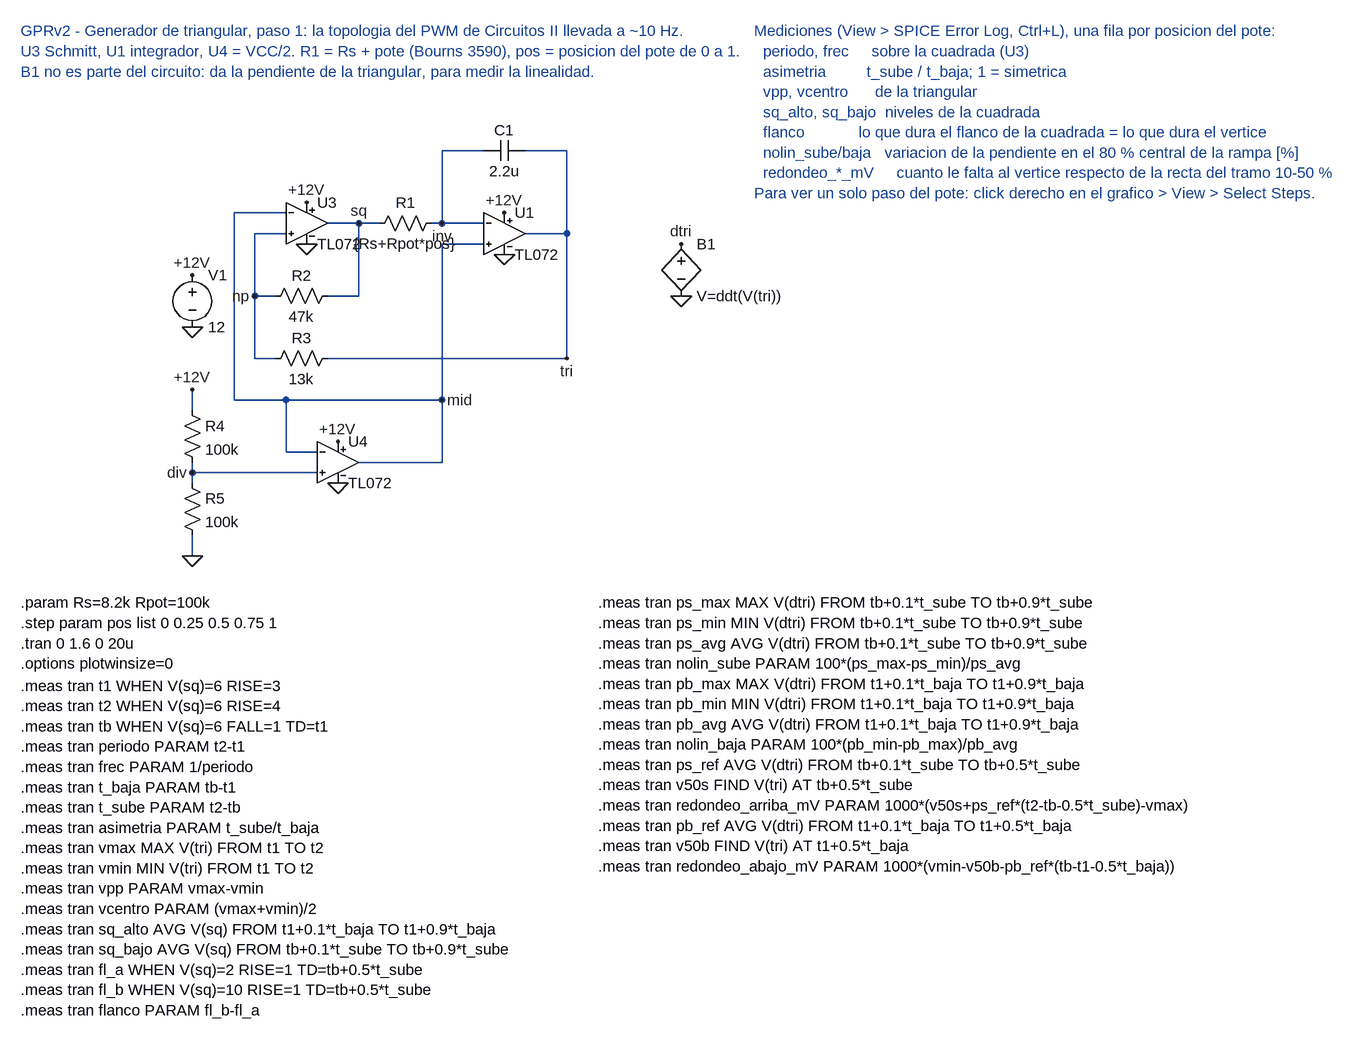
[diagram p0: schematic triangular.asc]
triangular.asc, the LTspice schematic file:
Version 4.1
SHEET 1 1592 1300
WIRE 384 -16 320 -16
WIRE 512 -16 448 -16
WIRE 80 80 0 80
WIRE 192 96 144 96
WIRE 224 96 192 96
WIRE 320 96 320 -16
WIRE 320 96 304 96
WIRE 384 96 320 96
WIRE 80 112 32 112
WIRE 512 112 512 -16
WIRE 512 112 448 112
WIRE 384 128 320 128
WIRE 32 208 32 112
WIRE 64 208 32 208
WIRE 192 208 192 96
WIRE 192 208 144 208
WIRE 32 304 32 208
WIRE 64 304 32 304
WIRE 512 304 512 112
WIRE 512 304 144 304
WIRE 0 368 0 80
WIRE 80 368 0 368
WIRE 320 368 320 128
WIRE 320 368 80 368
WIRE -64 384 -64 352
WIRE 80 448 80 368
WIRE 128 448 80 448
WIRE 320 464 320 368
WIRE 320 464 192 464
WIRE -64 480 -64 464
WIRE 128 480 -64 480
WIRE -64 496 -64 480
WIRE -64 608 -64 576
FLAG -64 256 0
FLAG -64 176 +12V
FLAG -64 608 0
FLAG 160 496 0
FLAG 112 128 0
FLAG 416 144 0
FLAG 112 64 +12V
FLAG 416 80 +12V
FLAG 160 432 +12V
FLAG -64 352 +12V
FLAG 192 96 sq
FLAG 32 208 np
FLAG 320 96 inv
FLAG 512 304 tri
FLAG 320 368 mid
FLAG -64 480 div
FLAG 688 128 dtri
FLAG 688 208 0
SYMBOL res 320 80 R90
WINDOW 0 0 56 VBottom 2
WINDOW 3 32 56 VTop 2
SYMATTR InstName R1
SYMATTR Value {Rs+Rpot*pos}
SYMBOL cap 448 -32 R90
WINDOW 0 0 32 VBottom 2
WINDOW 3 32 32 VTop 2
SYMATTR InstName C1
SYMATTR Value 2.2u
SYMBOL res 160 192 R90
WINDOW 0 0 56 VBottom 2
WINDOW 3 32 56 VTop 2
SYMATTR InstName R2
SYMATTR Value 47k
SYMBOL res 160 288 R90
WINDOW 0 0 56 VBottom 2
WINDOW 3 32 56 VTop 2
SYMATTR InstName R3
SYMATTR Value 13k
SYMBOL voltage -64 160 R0
WINDOW 123 0 0 Left 0
WINDOW 39 0 0 Left 0
SYMATTR InstName V1
SYMATTR Value 12
SYMBOL res -80 368 R0
SYMATTR InstName R4
SYMATTR Value 100k
SYMBOL res -80 480 R0
SYMATTR InstName R5
SYMATTR Value 100k
SYMBOL TL072 416 48 R0
SYMATTR InstName U1
SYMBOL TL072 112 32 R0
SYMATTR InstName U3
SYMBOL TL072 160 400 R0
SYMATTR InstName U4
SYMBOL bv 688 112 R0
SYMATTR InstName B1
SYMATTR Value V=ddt(V(tri))
TEXT -328 -200 Left 2 ;GPRv2 - Generador de triangular, paso 1: la topologia del PWM de Circuitos II llevada a ~10 Hz.\nU3 Schmitt, U1 integrador, U4 = VCC/2. R1 = Rs + pote (Bourns 3590), pos = posicion del pote de 0 a 1.\nB1 no es parte del circuito: da la pendiente de la triangular, para medir la linealidad.
TEXT -328 680 Left 2 !.param Rs=8.2k Rpot=100k\n.step param pos list 0 0.25 0.5 0.75 1\n.tran 0 1.6 0 20u\n.options plotwinsize=0
TEXT -328 808 Left 2 !.meas tran t1 WHEN V(sq)=6 RISE=3\n.meas tran t2 WHEN V(sq)=6 RISE=4\n.meas tran tb WHEN V(sq)=6 FALL=1 TD=t1\n.meas tran periodo PARAM t2-t1\n.meas tran frec PARAM 1/periodo\n.meas tran t_baja PARAM tb-t1\n.meas tran t_sube PARAM t2-tb\n.meas tran asimetria PARAM t_sube/t_baja\n.meas tran vmax MAX V(tri) FROM t1 TO t2\n.meas tran vmin MIN V(tri) FROM t1 TO t2\n.meas tran vpp PARAM vmax-vmin\n.meas tran vcentro PARAM (vmax+vmin)/2\n.meas tran sq_alto AVG V(sq) FROM t1+0.1*t_baja TO t1+0.9*t_baja\n.meas tran sq_bajo AVG V(sq) FROM tb+0.1*t_sube TO tb+0.9*t_sube\n.meas tran fl_a WHEN V(sq)=2 RISE=1 TD=tb+0.5*t_sube\n.meas tran fl_b WHEN V(sq)=10 RISE=1 TD=tb+0.5*t_sube\n.meas tran flanco PARAM fl_b-fl_a
TEXT 560 680 Left 2 !.meas tran ps_max MAX V(dtri) FROM tb+0.1*t_sube TO tb+0.9*t_sube\n.meas tran ps_min MIN V(dtri) FROM tb+0.1*t_sube TO tb+0.9*t_sube\n.meas tran ps_avg AVG V(dtri) FROM tb+0.1*t_sube TO tb+0.9*t_sube\n.meas tran nolin_sube PARAM 100*(ps_max-ps_min)/ps_avg\n.meas tran pb_max MAX V(dtri) FROM t1+0.1*t_baja TO t1+0.9*t_baja\n.meas tran pb_min MIN V(dtri) FROM t1+0.1*t_baja TO t1+0.9*t_baja\n.meas tran pb_avg AVG V(dtri) FROM t1+0.1*t_baja TO t1+0.9*t_baja\n.meas tran nolin_baja PARAM 100*(pb_min-pb_max)/pb_avg\n.meas tran ps_ref AVG V(dtri) FROM tb+0.1*t_sube TO tb+0.5*t_sube\n.meas tran v50s FIND V(tri) AT tb+0.5*t_sube\n.meas tran redondeo_arriba_mV PARAM 1000*(v50s+ps_ref*(t2-tb-0.5*t_sube)-vmax)\n.meas tran pb_ref AVG V(dtri) FROM t1+0.1*t_baja TO t1+0.5*t_baja\n.meas tran v50b FIND V(tri) AT t1+0.5*t_baja\n.meas tran redondeo_abajo_mV PARAM 1000*(vmin-v50b-pb_ref*(tb-t1-0.5*t_baja))
TEXT 800 -200 Left 2 ;Mediciones (View > SPICE Error Log, Ctrl+L), una fila por posicion del pote:\n  periodo, frec     sobre la cuadrada (U3)\n  asimetria         t_sube / t_baja; 1 = simetrica\n  vpp, vcentro      de la triangular\n  sq_alto, sq_bajo  niveles de la cuadrada\n  flanco            lo que dura el flanco de la cuadrada = lo que dura el vertice\n  nolin_sube/baja   variacion de la pendiente en el 80 % central de la rampa [%]\n  redondeo_*_mV     cuanto le falta al vertice respecto de la recta del tramo 10-50 %\nPara ver un solo paso del pote: click derecho en el grafico > View > Select Steps.

The netlist it stands for:
* triangular.asc
R1 inv sq {Rs+Rpot*pos}
C1 tri inv 2.2u
R2 sq np 47k
R3 tri np 13k
V1 +12V 0 12
R4 +12V div 100k
R5 div 0 100k
X§U1 mid inv +12V 0 tri TL072  ; pins In+ In- V+ V- OUT
X§U3 np mid +12V 0 sq TL072  ; pins In+ In- V+ V- OUT
X§U4 div mid +12V 0 mid TL072  ; pins In+ In- V+ V- OUT
B1 dtri 0 V=ddt(V(tri))
* GPRv2 - Generador de triangular, paso 1: la topologia del PWM de Circuitos II llevada a ~10 Hz.
* U3 Schmitt, U1 integrador, U4 = VCC/2. R1 = Rs + pote (Bourns 3590), pos = posicion del pote de 0 a 1.
* B1 no es parte del circuito: da la pendiente de la triangular, para medir la linealidad.
.param Rs=8.2k Rpot=100k
.step param pos list 0 0.25 0.5 0.75 1
.tran 0 1.6 0 20u
.options plotwinsize=0
.meas tran t1 WHEN V(sq)=6 RISE=3
.meas tran t2 WHEN V(sq)=6 RISE=4
.meas tran tb WHEN V(sq)=6 FALL=1 TD=t1
.meas tran periodo PARAM t2-t1
.meas tran frec PARAM 1/periodo
.meas tran t_baja PARAM tb-t1
.meas tran t_sube PARAM t2-tb
.meas tran asimetria PARAM t_sube/t_baja
.meas tran vmax MAX V(tri) FROM t1 TO t2
.meas tran vmin MIN V(tri) FROM t1 TO t2
.meas tran vpp PARAM vmax-vmin
.meas tran vcentro PARAM (vmax+vmin)/2
.meas tran sq_alto AVG V(sq) FROM t1+0.1*t_baja TO t1+0.9*t_baja
.meas tran sq_bajo AVG V(sq) FROM tb+0.1*t_sube TO tb+0.9*t_sube
.meas tran fl_a WHEN V(sq)=2 RISE=1 TD=tb+0.5*t_sube
.meas tran fl_b WHEN V(sq)=10 RISE=1 TD=tb+0.5*t_sube
.meas tran flanco PARAM fl_b-fl_a
.meas tran ps_max MAX V(dtri) FROM tb+0.1*t_sube TO tb+0.9*t_sube
.meas tran ps_min MIN V(dtri) FROM tb+0.1*t_sube TO tb+0.9*t_sube
.meas tran ps_avg AVG V(dtri) FROM tb+0.1*t_sube TO tb+0.9*t_sube
.meas tran nolin_sube PARAM 100*(ps_max-ps_min)/ps_avg
.meas tran pb_max MAX V(dtri) FROM t1+0.1*t_baja TO t1+0.9*t_baja
.meas tran pb_min MIN V(dtri) FROM t1+0.1*t_baja TO t1+0.9*t_baja
.meas tran pb_avg AVG V(dtri) FROM t1+0.1*t_baja TO t1+0.9*t_baja
.meas tran nolin_baja PARAM 100*(pb_min-pb_max)/pb_avg
.meas tran ps_ref AVG V(dtri) FROM tb+0.1*t_sube TO tb+0.5*t_sube
.meas tran v50s FIND V(tri) AT tb+0.5*t_sube
.meas tran redondeo_arriba_mV PARAM 1000*(v50s+ps_ref*(t2-tb-0.5*t_sube)-vmax)
.meas tran pb_ref AVG V(dtri) FROM t1+0.1*t_baja TO t1+0.5*t_baja
.meas tran v50b FIND V(tri) AT t1+0.5*t_baja
.meas tran redondeo_abajo_mV PARAM 1000*(vmin-v50b-pb_ref*(tb-t1-0.5*t_baja))
* Mediciones (View > SPICE Error Log, Ctrl+L), una fila por posicion del pote:
*   periodo, frec     sobre la cuadrada (U3)
*   asimetria         t_sube / t_baja; 1 = simetrica
*   vpp, vcentro      de la triangular
*   sq_alto, sq_bajo  niveles de la cuadrada
*   flanco            lo que dura el flanco de la cuadrada = lo que dura el vertice
*   nolin_sube/baja   variacion de la pendiente en el 80 % central de la rampa [%]
*   redondeo_*_mV     cuanto le falta al vertice respecto de la recta del tramo 10-50 %
* Para ver un solo paso del pote: click derecho en el grafico > View > Select Steps.
.lib TL072.sub
.backanno
.end

* Results of the author's LTspice run, read from the files saved beside the schematic
* Operating Point (first step), zero values left out:
*   V(sq) = 6 V
*   V(np) = 6 V
*   V(+12v) = 12 V
*   V(mid) = 6 V
*   V(inv) = 6 V
*   V(tri) = 6 V
*   V(div) = 6 V
*   I(R2) = 473.1 pA
*   I(V1) = -17.44 mA
*   I(R4) = 60 µA
*   I(R1) = -36.05 pA
*   I(R3) = -437.1 pA
*   I(R5) = 60 µA
*   Ix(u3:1) = 36.05 pA
*   Ix(u3:2) = 36.05 pA
*   Ix(u3:3) = 5.795 mA
*   Ix(u3:4) = -5.795 mA
*   Ix(u3:5) = -509.2 pA
*   Ix(u1:1) = 36.05 pA
*   Ix(u1:2) = 36.05 pA
*   Ix(u1:3) = 5.795 mA
*   Ix(u1:4) = -5.795 mA
*   Ix(u1:5) = 437.1 pA
*   Ix(u4:1) = 36.05 pA
*   Ix(u4:2) = 36.05 pA
*   Ix(u4:3) = 5.795 mA
*   Ix(u4:4) = -5.795 mA
*   Ix(u4:5) = -108.2 pA